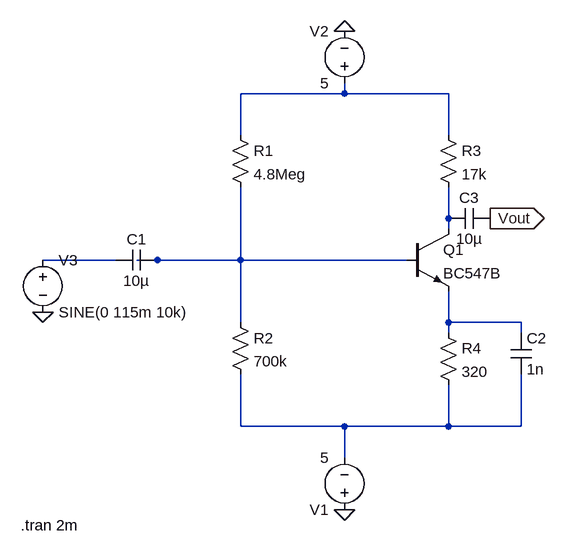
[diagram p0: schematic Gain.asc]
Gain.asc, the LTspice schematic file:
Version 4
SHEET 1 880 692
WIRE 304 -112 304 -128
WIRE 304 -112 144 -112
WIRE 464 -112 304 -112
WIRE 144 -48 144 -112
WIRE 464 -48 464 -112
WIRE 464 80 464 32
WIRE 464 96 464 80
WIRE -48 144 -160 144
WIRE 16 144 -16 144
WIRE 144 144 144 32
WIRE 144 144 16 144
WIRE 400 144 144 144
WIRE 144 240 144 144
WIRE 464 240 464 192
WIRE 576 240 464 240
WIRE 464 256 464 240
WIRE 576 256 576 240
WIRE 144 400 144 320
WIRE 304 400 144 400
WIRE 464 400 464 336
WIRE 464 400 304 400
WIRE 576 400 576 320
WIRE 576 400 464 400
WIRE 304 448 304 400
FLAG 304 528 0
FLAG 304 -208 0
FLAG 528 80 Vout
IOPIN 528 80 Out
FLAG -160 224 0
SYMBOL voltage 304 544 R180
WINDOW 123 0 0 Left 0
WINDOW 39 0 0 Left 0
SYMATTR InstName V1
SYMATTR Value 5
SYMBOL cap 16 128 R90
WINDOW 0 0 32 VBottom 2
WINDOW 3 32 32 VTop 2
SYMATTR InstName C1
SYMATTR Value 10µ
SYMBOL res 128 -64 R0
SYMATTR InstName R1
SYMATTR Value 4.8Meg
SYMBOL res 128 224 R0
SYMATTR InstName R2
SYMATTR Value 700k
SYMBOL npn 400 96 R0
SYMATTR InstName Q1
SYMATTR Value BC547B
SYMBOL res 448 -64 R0
SYMATTR InstName R3
SYMATTR Value 17k
SYMBOL res 448 240 R0
SYMATTR InstName R4
SYMATTR Value 320
SYMBOL cap 560 256 R0
SYMATTR InstName C2
SYMATTR Value 1n
SYMBOL cap 528 64 R90
WINDOW 0 0 32 VBottom 2
WINDOW 3 32 32 VTop 2
SYMATTR InstName C3
SYMATTR Value 10µ
SYMBOL voltage 304 -112 R180
WINDOW 0 24 96 Left 2
WINDOW 3 24 16 Left 2
WINDOW 123 0 0 Left 0
WINDOW 39 0 0 Left 0
SYMATTR InstName V2
SYMATTR Value 5
SYMBOL voltage -160 128 R0
WINDOW 123 0 0 Left 0
WINDOW 39 0 0 Left 0
SYMATTR InstName V3
SYMATTR Value SINE(0 115m 10k)
TEXT -194 552 Left 2 !.tran 2m

The netlist it stands for:
* Gain.asc
V1 0 N006 5
C1 N004 N003 10µ
R1 N001 N004 4.8Meg
R2 N004 N006 700k
Q1 N002 N004 N005 0 BC547B
R3 N001 N002 17k
R4 N005 N006 320
C2 N005 N006 1n
C3 Vout N002 10µ
V2 N001 0 5
V3 N003 0 SINE(0 115m 10k)
.model NPN NPN
.model PNP PNP
.lib standard.bjt
.tran 2m
.backanno
.end